# Altium schematic sheet SCH_USB-PD_Power.schdoc
size 407 x 248 mm
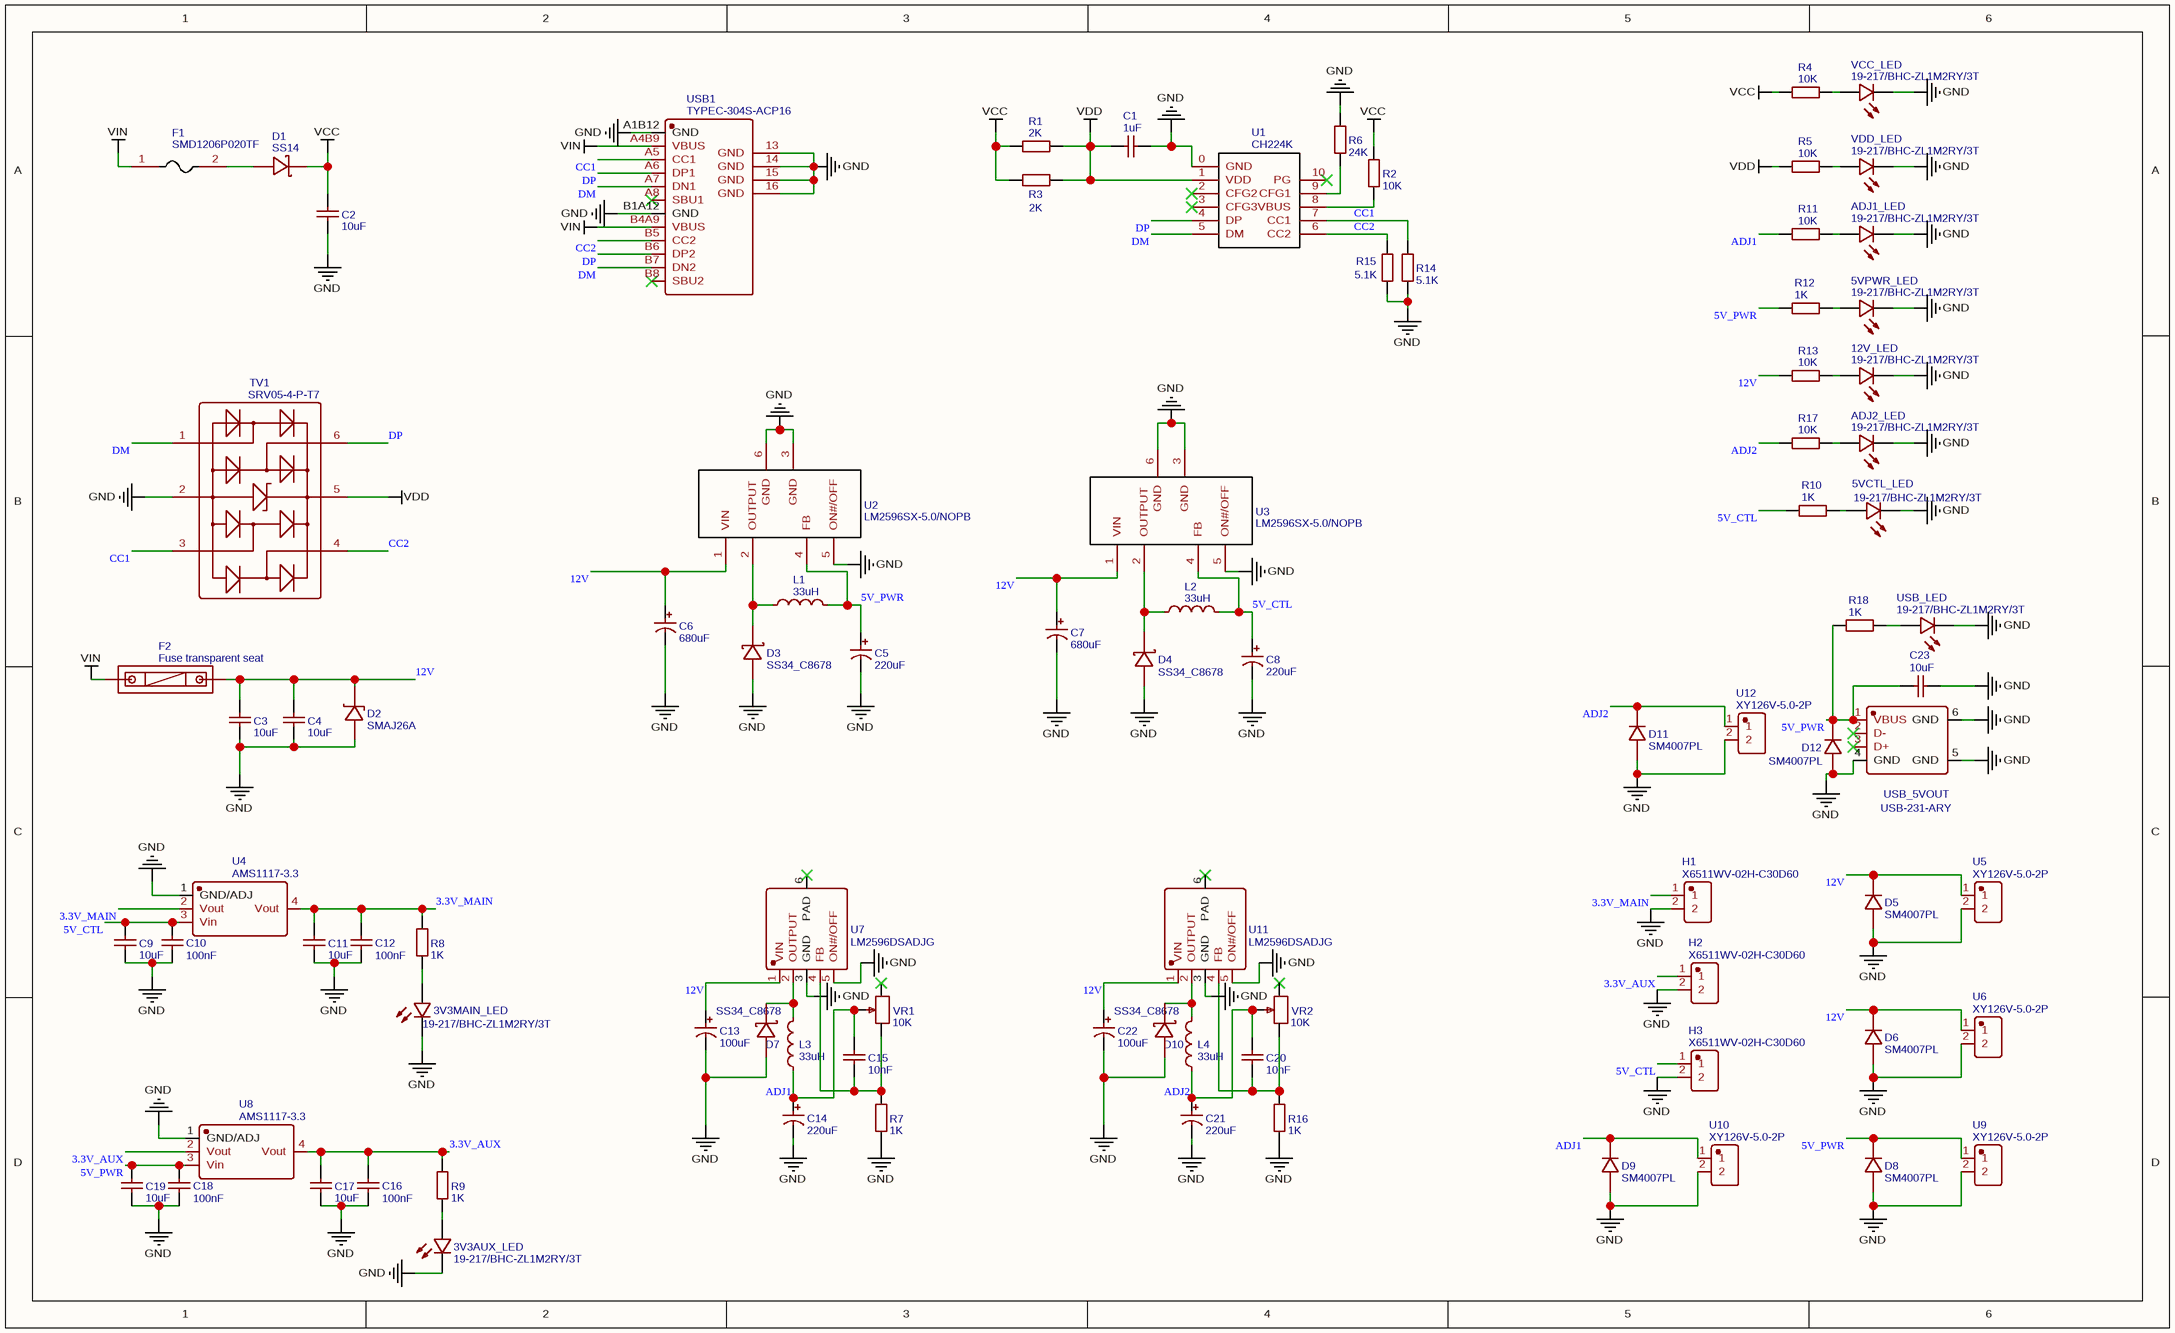
[diagram p0: SCH_USB-PD_Power.schdoc]

## Parts
3V3AUX_LED  19-217/BHC-ZL1M2RY/3T  [LED0603-R-RD]
3V3MAIN_LED  19-217/BHC-ZL1M2RY/3T  [LED0603-R-RD]
5VCTL_LED  19-217/BHC-ZL1M2RY/3T  [LED0603-R-RD]
5VPWR_LED  19-217/BHC-ZL1M2RY/3T  [LED0603-R-RD]
12V_LED  19-217/BHC-ZL1M2RY/3T  [LED0603-R-RD]
ADJ1_LED  19-217/BHC-ZL1M2RY/3T  [LED0603-R-RD]
ADJ2_LED  19-217/BHC-ZL1M2RY/3T  [LED0603-R-RD]
C1  1uF  [C0805]
C2  10uF  [C0805]
C3  10uF  [C0805]
C4  10uF  [C0805]
C5  220uF  [CAP-TH_BD8.0-P3.50-D1.0-FD]
C6  680uF  [CAP-TH_BD10.0-P5.00-D1.0-FD]
C7  680uF  [CAP-TH_BD10.0-P5.00-D1.0-FD]
C8  220uF  [CAP-TH_BD8.0-P3.50-D1.0-FD]
C9  10uF  [C0805]
C10  100nF  [C0805]
C11  10uF  [C0805]
C12  100nF  [C0805]
C13  100uF  [CAP-TH_BD10.0-P5.00-D1.0-FD]
C14  220uF  [CAP-TH_BD8.0-P3.50-D1.0-FD]
C15  10nF  [C0805]
C16  100nF  [C0805]
C17  10uF  [C0805]
C18  100nF  [C0805]
C19  10uF  [C0805]
C20  10nF  [C0805]
C21  220uF  [CAP-TH_BD8.0-P3.50-D1.0-FD]
C22  100uF  [CAP-TH_BD10.0-P5.00-D1.0-FD]
C23  10uF  [C0805]
D1  SS14  [SMA_L4.4-W2.8-LS5.4-RD]
D2  SMAJ26A  [SMA_L4.3-W2.6-LS5.2-RD]
D3  SS34_C8678  [DO-214AC_L4.3-W2.7-LS5.3-RD]
D4  SS34_C8678  [DO-214AC_L4.3-W2.7-LS5.3-RD]
D5  SM4007PL  [SOD-123F_L2.8-W1.8-LS3.7-RD]
D6  SM4007PL  [SOD-123F_L2.8-W1.8-LS3.7-RD]
D7  SS34_C8678  [DO-214AC_L4.3-W2.7-LS5.3-RD]
D8  SM4007PL  [SOD-123F_L2.8-W1.8-LS3.7-RD]
D9  SM4007PL  [SOD-123F_L2.8-W1.8-LS3.7-RD]
D10  SS34_C8678  [DO-214AC_L4.3-W2.7-LS5.3-RD]
D11  SM4007PL  [SOD-123F_L2.8-W1.8-LS3.7-RD]
D12  SM4007PL  [SOD-123F_L2.8-W1.8-LS3.7-RD]
F1  SMD1206P020TF  [F1206]
F2  Fuse transparent seat  [FUSE-TH_L22.6-W9.0]
H1  X6511WV-02H-C30D60  [HDR-TH_2P-P2.54-V-M]
H2  X6511WV-02H-C30D60  [HDR-TH_2P-P2.54-V-M]
H3  X6511WV-02H-C30D60  [HDR-TH_2P-P2.54-V-M]
L1  33uH  [IND-SMD_L12.5-W12.5]
L2  33uH  [IND-SMD_L12.5-W12.5]
L3  33uH  [IND-SMD_L12.5-W12.5]
L4  33uH  [IND-SMD_L12.5-W12.5]
R1  2K  [R0805]
R2  10K  [R0805]
R3  2K  [R0805]
R4  10K  [R0805]
R5  10K  [R0805]
R6  24K  [R0805]
R7  1K  [R0805]
R8  1K  [R0805]
R9  1K  [R0805]
R10  1K  [R0805]
R11  10K  [R0805]
R12  1K  [R0805]
R13  10K  [R0805]
R14  5.1K  [R0805]
R15  5.1K  [R0805]
R16  1K  [R0805]
R17  10K  [R0805]
R18  1K  [R0805]
TV1  SRV05-4-P-T7  [SOT-23-6_L2.9-W1.6-P0.95-LS2.8-BR]
U1  CH224K  [ESSOP10-EP]
U2  LM2596SX-5.0/NOPB  [TO-263-5_L10.2-W9.9-P1.70-LS14.4-TL]
U3  LM2596SX-5.0/NOPB  [TO-263-5_L10.2-W9.9-P1.70-LS14.4-TL]
U4  AMS1117-3.3  [SOT-223-3_L6.5-W3.4-P2.30-LS7.0-BR]
U5  XY126V-5.0-2P  [CONN-TH_XY126V-5.0-2P]
U6  XY126V-5.0-2P  [CONN-TH_XY126V-5.0-2P]
U7  LM2596DSADJG  [TO-263-5_L10.6-W9.6-P1.70-LS15.9-TL]
U8  AMS1117-3.3  [SOT-223-3_L6.5-W3.4-P2.30-LS7.0-BR]
U9  XY126V-5.0-2P  [CONN-TH_XY126V-5.0-2P]
U10  XY126V-5.0-2P  [CONN-TH_XY126V-5.0-2P]
U11  LM2596DSADJG  [TO-263-5_L10.6-W9.6-P1.70-LS15.9-TL]
U12  XY126V-5.0-2P  [CONN-TH_XY126V-5.0-2P]
USB1  TYPEC-304S-ACP16  [USB-C-SMD_TYPEC-304S-ACP16]
USB_5VOUT  USB-231-ARY  [USB-A-TH_USB-231-ARY]
USB_LED  19-217/BHC-ZL1M2RY/3T  [LED0603-R-RD]
VCC_LED  19-217/BHC-ZL1M2RY/3T  [LED0603-R-RD]
VDD_LED  19-217/BHC-ZL1M2RY/3T  [LED0603-R-RD]
VR1  10K  [RES-ADJ-TH_3362P]
VR2  10K  [RES-ADJ-TH_3362P]

## Nets
GND: 3V3AUX_LED.2(C) 3V3MAIN_LED.2(C) 5VCTL_LED.2(C) 5VPWR_LED.2(C) 12V_LED.2(C) ADJ1_LED.2(C) ADJ2_LED.2(C) C1.2 C2.1 C3.1 C4.1 C5.2 C6.2 C7.2 C8.2 C9.1 C10.1 C11.1 C12.1 C13.2 C14.2 C16.1 C17.1 C18.1 C19.1 C21.2 C22.2 C23.2 D2.2(A) D3.2(A) D4.2(A) D5.2(A) D6.2(A) D7.2(A) D8.2(A) D9.2(A) D10.2(A) D11.2(A) D12.2(A) H1.2 H2.2 H3.2 R6.2 R7.1 R14.1 R15.1 R16.1 TV1.2 U1.0(GND) U2.3(GND) U2.5(ON#/OFF) U2.6(GND) U3.3(GND) U3.5(ON#/OFF) U3.6(GND) U4.1(GND/ADJ) U5.2 U6.2 U7.3(GND) U7.5(ON#/OFF) U8.1(GND/ADJ) U9.2 U10.2 U11.3(GND) U11.5(ON#/OFF) U12.2 USB1.13(GND) USB1.14(GND) USB1.15(GND) USB1.16(GND) USB1.A1B12(GND) USB1.B1A12(GND) USB_5VOUT.4(GND) USB_5VOUT.5(GND) USB_5VOUT.6(GND) USB_LED.2(C) VCC_LED.2(C) VDD_LED.2(C)
VCC: C2.2 D1.1(K) R1.1 R2.2 R3.1 R4.2
VDD: C1.1 R1.2 R3.2 R5.2 TV1.5 U1.1(VDD)
VIN: F1.1 F2.1 USB1.A4B9(VBUS) USB1.B4A9(VBUS)
3.3V_AUX: C16.2 C17.2 H2.1 R9.2 U8.2(Vout) U8.4(Vout)
3.3V_MAIN: C11.2 C12.2 H1.1 R8.2 U4.2(Vout) U4.4(Vout)
5V_CTL: C8.1 C9.2 C10.2 H3.1 L2.2 R10.2 U3.4(FB) U4.3(Vin)
5V_PWR: C5.1 C18.2 C19.2 C23.1 D8.1(C) D12.1(C) L1.2 R12.2 R18.1 U2.4(FB) U8.3(Vin) U9.1 USB_5VOUT.1(VBUS)
12V: C3.2 C4.2 C6.1 C7.1 C13.1 C22.1 D2.1(K) D5.1(C) D6.1(C) F2.2 R13.2 U2.1(VIN) U3.1(VIN) U5.1 U6.1 U7.1(VIN) U11.1(VIN)
ADJ1: C14.1 C15.2 D9.1(C) L3.1 R11.2 U10.1 VR1.2
ADJ2: C20.2 C21.1 D11.1(C) L4.1 R17.2 U12.1 VR2.2
CC1: R14.2 TV1.3 U1.7(CC1) USB1.A5(CC1)
CC2: R15.2 TV1.4 U1.6(CC2) USB1.B5(CC2)
DM: TV1.1 U1.5(DM) USB1.A7(DN1) USB1.B7(DN2)
DP: TV1.6 U1.4(DP) USB1.A6(DP1) USB1.B6(DP2)
Net3V3AUX_LED_1: 3V3AUX_LED.1(A) R9.1
Net3V3MAIN_LED_1: 3V3MAIN_LED.1(A) R8.1
Net5VCTL_LED_1: 5VCTL_LED.1(A) R10.1
Net5VPWR_LED_1: 5VPWR_LED.1(A) R12.1
Net12V_LED_1: 12V_LED.1(A) R13.1
NetADJ1_LED_1: ADJ1_LED.1(A) R11.1
NetADJ2_LED_1: ADJ2_LED.1(A) R17.1
NetC15_1: C15.1 R7.2 U7.4(FB) VR1.3
NetC20_1: C20.1 R16.2 U11.4(FB) VR2.3
NetD1_2: D1.2(A) F1.2
NetD3_1: D3.1(K) L1.1 U2.2(OUTPUT)
NetD4_1: D4.1(K) L2.1 U3.2(OUTPUT)
NetD7_1: D7.1(K) L3.2 U7.2(OUTPUT)
NetD10_1: D10.1(K) L4.2 U11.2(OUTPUT)
NetR2_1: R2.1 U1.8(VBUS)
NetR4_1: R4.1 VCC_LED.1(A)
NetR5_1: R5.1 VDD_LED.1(A)
NetR6_1: R6.1 U1.9(CFG1)
NetR18_2: R18.2 USB_LED.1(A)

Not connected (* = marked no-connect by the designer): U1 2(CFG2)* 3(CFG3)* 10(PG)*; U7 6(PAD)*; U11 6(PAD)*; USB1 A8(SBU1)* B8(SBU2)*; USB_5VOUT 2(D-)* 3(D+)*; VR1 1*; VR2 1*

## Library data of the parts
3V3AUX_LED 3V3MAIN_LED 5VCTL_LED 5VPWR_LED 12V_LED ADJ1_LED ADJ2_LED USB_LED VCC_LED VDD_LED = 19-217/BHC-ZL1M2RY/3T: BOM_Manufacturer: EVERLIGHT; SMT Type: Basic; BOM_Supplier: LCSC; BOM_Manufacturer Part: 19-217/BHC-ZL1M2RY/3T; BOM_LCSC Assembly: Yes; image: //image.lceda.cn/szlcsc/C72041.jpg; BOM_Supplier Part: C72041; spicePre: L; spiceSymbolName: 19-217/BHC-ZL1M2RY/3T
C1 = 1uF: BOM_Manufacturer Part: CL21B105KBFNNNE; BOM_Manufacturer: SAMSUNG; nameAlias: Capacitance; SMT Type: Basic; BOM_Supplier: LCSC; BOM_LCSC Assembly: Yes; BOM_Supplier Part: C28323; spicePre: C; spiceSymbolName: CL21B105KBFNNNE
C2-C4 C9 C11 C17 C19 C23 = 10uF: BOM_Manufacturer Part: CL21A106KAYNNNE; BOM_Manufacturer: SAMSUNG; nameAlias: Capacitance; SMT Type: Basic; BOM_Supplier: LCSC; BOM_Supplier Part: C15850; spicePre: C; spiceSymbolName: CL21A106KAYNNNE
  C2-C4 C9 C11 C17 C19: BOM_LCSC Assembly: Yes
  C23: BOM_JLCPCB SMD: Yes
C5 C8 C14 C21 = 220uF: BOM_Manufacturer: ValuePro; BOM_Manufacturer Part: 220uf/35V; nameAlias: Capacitance; BOM_Supplier: LCSC; BOM_Supplier Part: C2063; spicePre: C; spiceSymbolName: 220uf/35V
C6 C7 = 680uF: BOM_Manufacturer: SAMYOUNG; BOM_Manufacturer Part: NXA25V680UF10*16; nameAlias: Capacitance; Contributor: LCSC; BOM_Supplier: LCSC; BOM_Supplier Part: C150380; spicePre: C; spiceSymbolName: NXA25V680UF10*16
C10 C12 C16 C18 = 100nF: BOM_Manufacturer Part: CC0805KRX7R9BB104; BOM_Manufacturer: YAGEO; nameAlias: Capacitance; SMT Type: Basic; BOM_Supplier: LCSC; BOM_LCSC Assembly: Yes; BOM_Supplier Part: C49678; spicePre: C; spiceSymbolName: CC0805KRX7R9BB104
C13 C22 = 100uF: BOM_Manufacturer: ValuePro; BOM_Manufacturer Part: 100uF 63V 10*13; nameAlias: Capacitance; BOM_Supplier: LCSC; BOM_Supplier Part: C45675; spicePre: C; spiceSymbolName: 100uF 63V 10*13
C15 C20 = 10nF: BOM_Manufacturer Part: CL21B103KBANNNC; BOM_Manufacturer: SAMSUNG; nameAlias: Capacitance; SMT Type: Basic; BOM_Supplier: LCSC; BOM_LCSC Assembly: Yes; BOM_Supplier Part: C1710; spicePre: C; spiceSymbolName: CL21B103KBANNNC
D1 = SS14: BOM_Manufacturer: MDD; SMT Type: Basic; BOM_Supplier: LCSC; BOM_Manufacturer Part: SS14; image: //image.lceda.cn/szlcsc/C2480.jpg; BOM_Supplier Part: C2480; BOM_LCSC Assembly: Yes; spicePre: D; spiceSymbolName: SS14
D2 = SMAJ26A: BOM_Manufacturer: RUILON; SMT Type: Extend; BOM_Supplier: LCSC; BOM_Manufacturer Part: SMAJ26A; image: //image.lceda.cn/szlcsc/C49370.jpg; BOM_Supplier Part: C49370; BOM_LCSC Assembly: Yes; spicePre: D; spiceSymbolName: SMAJ26A
D3 D4 D7 D10 = SS34_C8678: BOM_Manufacturer Part: SS34; BOM_Manufacturer: MDD; SMT Type: Basic; BOM_Supplier: LCSC; image: //image.lceda.cn/szlcsc/C8678.jpg; BOM_Supplier Part: C8678; BOM_LCSC Assembly: Yes; spicePre: D; spiceSymbolName: SS34_C8678
D5 D6 D8 D9 D11 D12 = SM4007PL: BOM_Manufacturer: MDD; SMT Type: Basic; BOM_Supplier: LCSC; BOM_Manufacturer Part: SM4007PL; image: //image.lceda.cn/szlcsc/C64898.jpg; BOM_Supplier Part: C64898; BOM_LCSC Assembly: Yes; spicePre: D; spiceSymbolName: SM4007PL
F1 = SMD1206P020TF: BOM_Manufacturer: RUILON; SMT Type: Extend; BOM_Supplier: LCSC; BOM_Manufacturer Part: SMD1206P020TF; image: //image.lceda.cn/szlcsc/C20984.jpg; BOM_Supplier Part: C20984; BOM_LCSC Assembly: Yes; spicePre: F; spiceSymbolName: SMD1206P020TF
F2 = Fuse transparent seat: BOM_Manufacturer: ReliaPro; BOM_Supplier: LCSC; BOM_Manufacturer Part: Fuse transparent seat; image: //image.lceda.cn/szlcsc/C58066.jpg; BOM_Supplier Part: C58066; spicePre: F; spiceSymbolName: Fuse transparent seat
H1-H3 = X6511WV-02H-C30D60: BOM_Manufacturer: XKB Connectivity; Contributor: LCSC; BOM_Supplier: LCSC; BOM_Supplier Part: C706874; BOM_Manufacturer Part: X6511WV-02H-C30D60; spicePre: H; spiceSymbolName: X6511WV-02H-C30D60
L1-L4 = 33uH: BOM_Manufacturer: Sunlord; BOM_Manufacturer Part: SWRB1207S-330MT; nameAlias: Inductance; Contributor: LCSC; SMT Type: Extend; BOM_Supplier: LCSC; BOM_Supplier Part: C169375; BOM_LCSC Assembly: Yes; spicePre: L; spiceSymbolName: SWRB1207S-330MT
R1 R3 = 2K: BOM_Manufacturer: UniOhm; BOM_Manufacturer Part: 0805W8F2001T5E; nameAlias: Resistance (Ohms); SMT Type: Basic; BOM_Supplier: LCSC; BOM_LCSC Assembly: Yes; BOM_Supplier Part: C17604; spicePre: R; spiceSymbolName: 0805W8F2001T5E
R2 R4 R5 R11 R13 R17 = 10K: BOM_Manufacturer: UniOhm; BOM_Manufacturer Part: 0805W8F1002T5E; nameAlias: Resistance (Ohms); SMT Type: Basic; BOM_Supplier: LCSC; BOM_LCSC Assembly: Yes; BOM_Supplier Part: C17414; spicePre: R; spiceSymbolName: 0805W8F1002T5E
R6 = 24K: BOM_Manufacturer: UniOhm; BOM_Manufacturer Part: 0805W8F2402T5E; nameAlias: Resistance (Ohms); SMT Type: Basic; BOM_Supplier: LCSC; BOM_LCSC Assembly: Yes; BOM_Supplier Part: C17575; spicePre: R; spiceSymbolName: 0805W8F2402T5E
R7-R10 R12 R16 R18 = 1K: BOM_Manufacturer: UniOhm; BOM_Manufacturer Part: 0805W8F1001T5E; nameAlias: Resistance (Ohms); SMT Type: Basic; BOM_Supplier: LCSC; BOM_LCSC Assembly: Yes; BOM_Supplier Part: C17513; spicePre: R; spiceSymbolName: 0805W8F1001T5E
R14 R15 = 5.1K: BOM_Manufacturer: UniOhm; BOM_Manufacturer Part: 0805W8F5101T5E; nameAlias: Resistance (Ohms); SMT Type: Basic; BOM_Supplier: LCSC; BOM_Supplier Part: C27834; BOM_JLCPCB SMD: Yes; spicePre: R; spiceSymbolName: 0805W8F5101T5E
TV1 = SRV05-4-P-T7: BOM_Manufacturer: PROTEK; SMT Type: Basic; BOM_Supplier: LCSC; BOM_Manufacturer Part: SRV05-4-P-T7; BOM_LCSC Assembly: Yes; image: //image.lceda.cn/szlcsc/C85364.jpg; BOM_Supplier Part: C85364; spicePre: T; spiceSymbolName: SRV05-4-P-T7
U1 = CH224K: BOM_Manufacturer: 南京沁恒微电子; Contributor: hans_1024; spicePre: U; spiceSymbolName: CH224K
U2 U3 = LM2596SX-5.0/NOPB: BOM_Manufacturer: TI; SMT Type: Basic; BOM_Supplier: LCSC; BOM_Manufacturer Part: LM2596SX-5.0/NOPB; BOM_LCSC Assembly: Yes; image: //image.lceda.cn/szlcsc/C10002.jpg; BOM_Supplier Part: C10002; spicePre: U; spiceSymbolName: LM2596SX-5.0/NOPB
U4 U8 = AMS1117-3.3: BOM_Manufacturer: AMS; sourceId: dwIGgezVh; SMT Type: Basic; timeStamp: 1476261164; BOM_Supplier: LCSC; BOM_Manufacturer Part: AMS1117-3.3; BOM_LCSC Assembly: Yes; image: //image.lceda.cn/szlcsc/C6186.jpg; BOM_Supplier Part: C6186; spicePre: U; spiceSymbolName: AMS1117-3.3
U5 U6 U9 U10 U12 = XY126V-5.0-2P: Contributor: LCSC; BOM_Supplier: LCSC; BOM_Supplier Part: C557646; BOM_Manufacturer: --; BOM_Manufacturer Part: XY126V-5.0-2P; spicePre: U; spiceSymbolName: XY126V-5.0-2P
U7 U11 = LM2596DSADJG: BOM_Manufacturer: ON; SMT Type: Extend; BOM_Supplier: LCSC; BOM_Manufacturer Part: LM2596DSADJG; BOM_Supplier Part: C92134; BOM_LCSC Assembly: Yes; spicePre: U; spiceSymbolName: LM2596DSADJG
USB1 = TYPEC-304S-ACP16: BOM_Manufacturer: XUNPU; Contributor: LCSC; BOM_Paste Type: expand; BOM_Assembly Type: smtWeld; BOM_Supplier: LCSC; BOM_Supplier Part: C720630; BOM_Manufacturer Part: TYPEC-304S-ACP16; spicePre: U; spiceSymbolName: TYPEC-304S-ACP16
USB_5VOUT = USB-231-ARY: BOM_Manufacturer: XUNPU; Contributor: LCSC; SMT Type: Extend; BOM_Supplier: LCSC; BOM_Supplier Part: C720525; BOM_Manufacturer Part: USB-231-ARY; BOM_JLCPCB SMD: Yes; spicePre: U; spiceSymbolName: USB-231-ARY
VR1 VR2 = 10K: BOM_Manufacturer: BOURNS; BOM_Manufacturer Part: 3362P-1-103LF; nameAlias: Resistance (Ohms); BOM_Supplier: LCSC; BOM_Supplier Part: C58159; Resistance(Ohms): 10K; spicePre: V; spiceSymbolName: 3362P-1-103LF